# Altium schematic sheet User Control Interface.SchDoc
size A4; Author: Azmat Bilal; Organization: Shamrock Green; Revision: 1.0.0; SheetNumber: 4; SheetTotal: 4
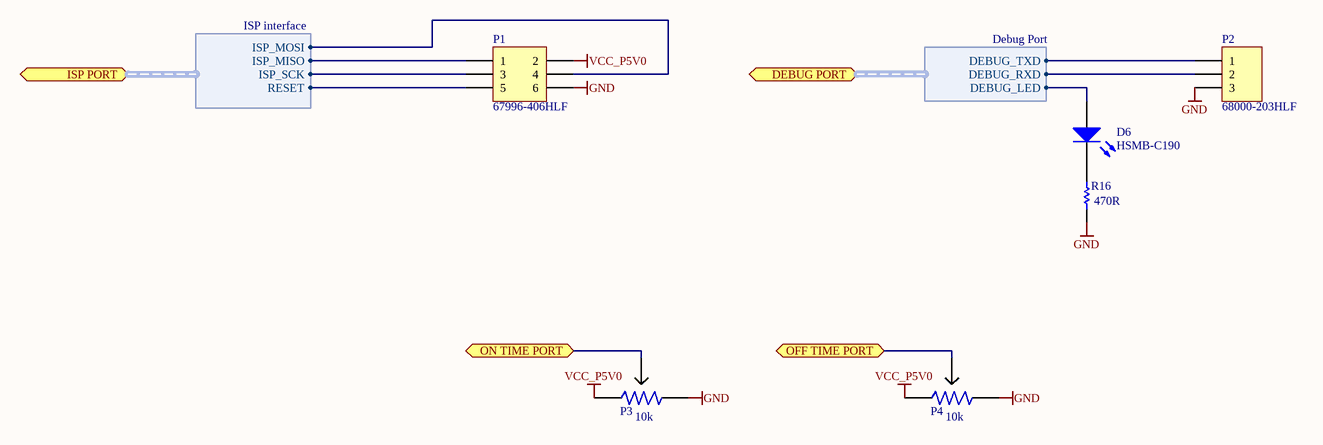
[diagram p0: User Control Interface.SchDoc]

## Parts
D6  HSMB-C190  [1.6X0.8X0.8]
P1  67996-406HLF  [HDR2X3]
P2  68000-203HLF  [HDR1X3]
P3  value 10k  [PS30-10PB10BRxxx]  (hidden comment: PS30-10PB10BR10K)
P4  value 10k  [PS30-10PB10BRxxx]  (hidden comment: PS30-10PB10BR10K)
R16  value 470R  [3-0603]  (hidden comment: ERJ3GEYJ471V)

## Ports
DEBUG PORT (harness Debug Port), ISP PORT (harness ISP interface), OFF TIME PORT, ON TIME PORT

## Harnesses
ISP interface: ISP_MISO, ISP_MOSI, ISP_SCK, RESET
Debug Port: DEBUG_LED, DEBUG_RXD, DEBUG_TXD

## Nets
GND: P1.6 P2.3 P3.3 P4.3 R16.1
VCC_P5V0: P1.2 P3.1 P4.1
OFF TIME PORT: P4.2 ; port OFF TIME PORT
ON TIME PORT: P3.2 ; port ON TIME PORT
NetD6_1: D6.1(A) ; port DEBUG PORT.DEBUG_LED
NetD6_2: D6.2(K) R16.2
NetP1_1: P1.1 ; port ISP PORT.ISP_MISO
NetP1_3: P1.3 ; port ISP PORT.ISP_SCK
NetP1_4: P1.4 ; port ISP PORT.ISP_MOSI
NetP1_5: P1.5 ; port ISP PORT.RESET
NetP2_1: P2.1 ; port DEBUG PORT.DEBUG_TXD
NetP2_2: P2.2 ; port DEBUG PORT.DEBUG_RXD

## Notes on the sheet
- Project:
- Auther:
- Sheet
- of
- Shamrock Green
- Date:
- Revision:
- Time:

## Library data of the parts
D6 = HSMB-C190: Blue Surface Mount Chip LED, Blue; LuminousIntensity: 1.6mcd (Minimum).; PCB_Layout: Complies with manufacturer's recommendation.; Published: 11-Dec-2002; DatasheetVersion: 26-Feb-2002; PackageVersion: Mar-2002; PackageReference: 1.6X0.8X0.8; Publisher: Altium Limited; PackageDescription: SM LED; 2 Flat Leads; LED_Colour: Blue; ComponentLink1Description: Manufacturer Link; ComponentLink1URL: http://www.avagotech.com/; ComponentLink2Description: Datasheet; ComponentLink2URL: http://cp.literature.agilent.com/litweb/pdf/5988-5211EN.pdf
P1 = Header 3X2: Header, 3-Pin, Dual row; LatestRevisionDate: 17-Jul-2002; LatestRevisionNote: Re-released for DXP Platform.; Publisher: Altium Limited
P2 = Header 3: Header, 3-Pin; LatestRevisionDate: 17-Jul-2002; LatestRevisionNote: Re-released for DXP Platform.; Publisher: Altium Limited
P3 P4 = PSxx-10PB10BRxxx: slide potentiometer
R16 = ERJ3GE: Thick Film Chip Resistor, 1 Ohm to 10M Ohm Range, 5% Tolerance, 0603 Size, 0.1 W; Note: If flow soldering, adjust pad width of PCB Footprint to 0.7 - 0.8 times the width of the resistor.; Published: 17-Dec-2003; LatestRevisionDate: 19-Mar-2004; LatestRevisionNote: Silkscreen size reduced.; PackageDocument: Mar-2003; PackageReference: 3-0603; Publisher: Altium Limited; Code_IPC: 1608 [0603]; ComponentLink1Description: Manufacturer Link; ComponentLink1URL: http://www.panasonic.com/industrial/components/resistive_products.htm; ComponentLink2Description: Datasheet; ComponentLink2URL: http://www.panasonic.com/industrial/components/pdf/AOA0000CE1.pdf